# Altium schematic sheet rs232_pic.SchDoc
size A4
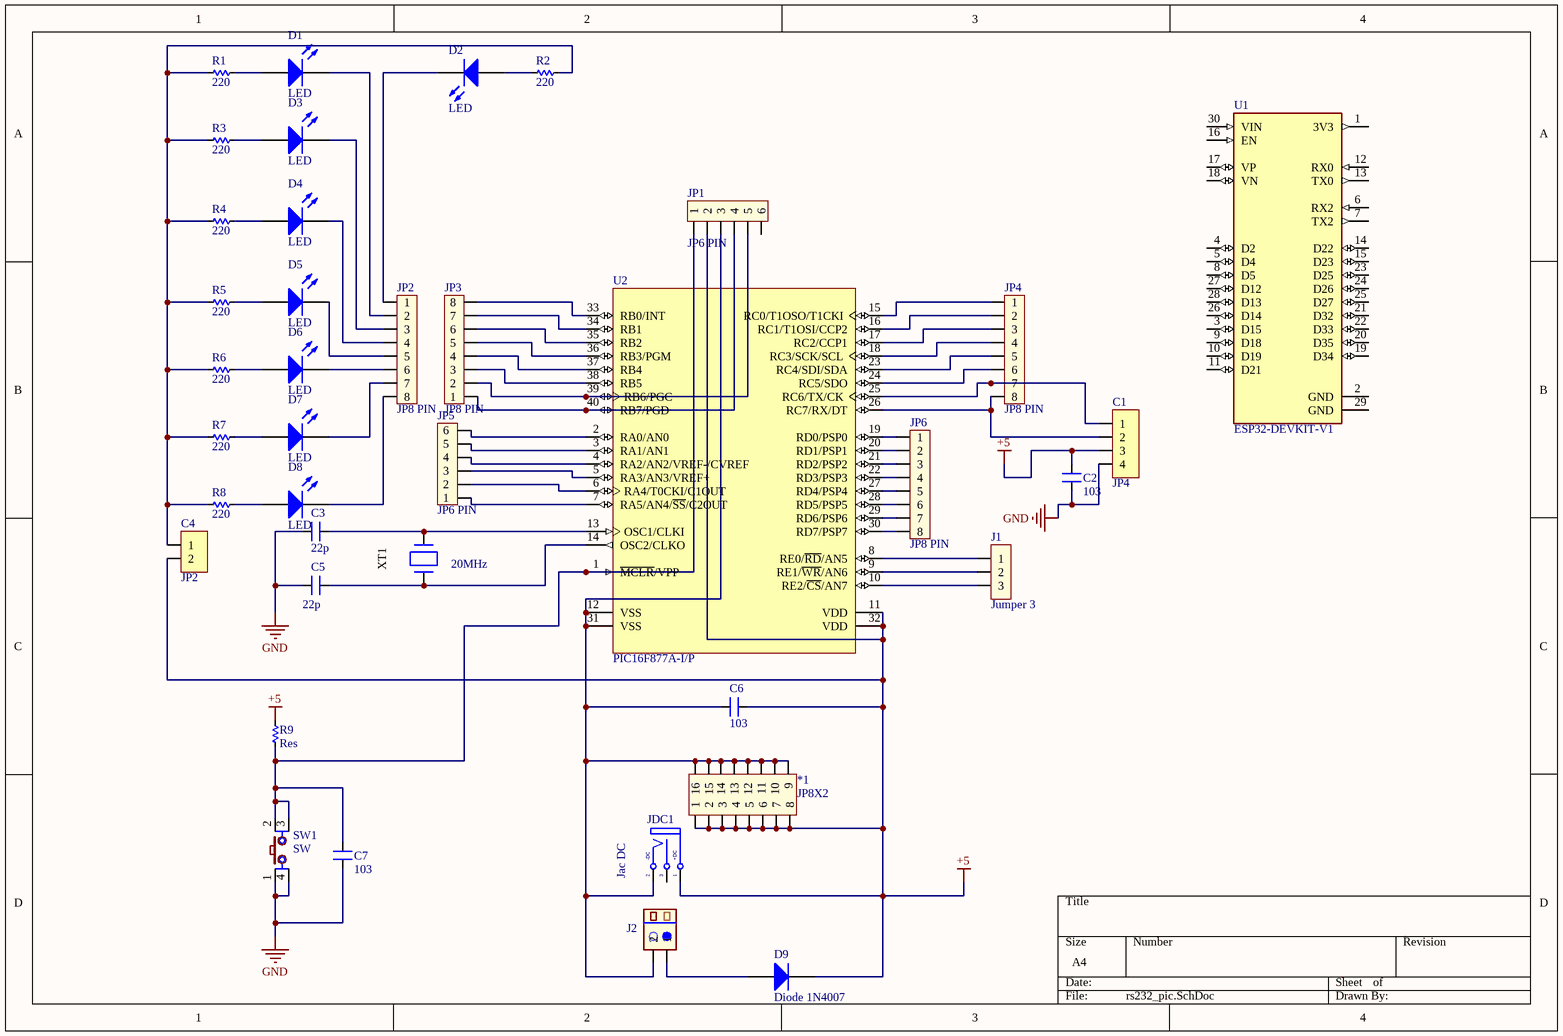
[diagram p0: rs232_pic.SchDoc]

## Parts
*1  JP8X2  [JP8X2]
C1  JP4  [JP4-C1T]
C2  103  [CN1.5]
C3  22p  [CN1.5]
C4  JP2  [JP2-CLOSED]
C5  22p  [CN1.5]
C6  103  [CN1.5]
C7  103  [CN1.5]
D1  LED  [LED-0 5mm BLUE]
D2  LED  [LED-0 5mm BLUE]
D3  LED  [LED-0 5mm BLUE]
D4  LED  [LED-0 5mm BLUE]
D5  LED  [LED-0 5mm BLUE]
D6  LED  [LED-0 5mm BLUE]
D7  LED  [LED-0 5mm BLUE]
D8  LED  [LED-0 5mm BLUE]
D9  Diode 1N4007  [DO-41]
J1  Jumper 3  [JP3]
J2  CON.Domino2  [Domino 2M]  (value not drawn)
JDC1  Jac DC  [DC0]
JP1  JP6 PIN  [JP6]
JP2  JP8 PIN  [JP8]
JP3  JP8 PIN  [JP8]
JP4  JP8 PIN  [JP8]
JP5  JP6 PIN  [JP6]
JP6  JP8 PIN  [JP8]
R1  220  [RES-1/2W]
R2  220  [RES-1/2W]
R3  220  [RES-1/2W]
R4  220  [RES-1/2W]
R5  220  [RES-1/2W]
R6  220  [RES-1/2W]
R7  220  [RES-1/2W]
R8  220  [RES-1/2W]
R9  Res  [RES-1/2W]
SW1  SW  [SW2-DIP]
U1  ESP32-DEVKIT-V1  [MODULE_ESP32_DEVKIT_V1]
U2  PIC16F877A-I/P  [DIP-40]
XT1  value 20MHz  [Crystal.HC49_N]  (hidden comment: Crystal2)

## Nets
+5: *1.1 *1.2 *1.3 *1.4 *1.5 *1.6 *1.7 *1.8 C1.3 C2.1 C4.2 C6.2 D9.2(K) JDC1.1(T) JP1.2 R9.1 U2.11(VDD) U2.32(VDD)
GND: C1.4 C2.2 C3.1 C5.1 C7.2 SW1.1 SW1.4
Net*1_9: *1.9 *1.10 *1.11 *1.12 *1.13 *1.14 *1.15 *1.16 C6.1 J2.2 JDC1.2(TN) JP1.3 U2.12(VSS) U2.31(VSS)
NetC1_1: C1.1 JP4.7 U2.25(RC6/TX/CK)
NetC1_2: C1.2 JP4.8 U2.26(RC7/RX/DT)
NetC3_2: C3.2 U2.13(OSC1/CLKI) XT1.2
NetC4_1: C4.1 R1.1 R2.1 R3.1 R4.1 R5.1 R6.1 R7.1 R8.1
NetC5_2: C5.2 U2.14(OSC2/CLKO) XT1.1
NetC7_1: C7.1 JP1.1 R9.2 SW1.2 SW1.3 U2.1(~{MCLR}/VPP)
NetD1_1: D1.1(A) R1.2
NetD1_2: D1.2(K) JP2.2
NetD2_1: D2.1(A) R2.2
NetD2_2: D2.2(K) JP2.1
NetD3_1: D3.1(A) R3.2
NetD3_2: D3.2(K) JP2.3
NetD4_1: D4.1(A) R4.2
NetD4_2: D4.2(K) JP2.4
NetD5_1: D5.1(A) R5.2
NetD5_2: D5.2(K) JP2.5
NetD6_1: D6.1(A) R6.2
NetD6_2: D6.2(K) JP2.6
NetD7_1: D7.1(A) R7.2
NetD7_2: D7.2(K) JP2.7
NetD8_1: D8.1(A) R8.2
NetD8_2: D8.2(K) JP2.8
NetD9_1: D9.1(A) J2.1
NetJ1_1: J1.1 U2.8(RE0/~{RD}/AN5)
NetJ1_2: J1.2 U2.9(RE1/~{WR}/AN6)
NetJ1_3: J1.3 U2.10(RE2/~{CS}/AN7)
NetJP1_4: JP1.4 JP3.1 U2.40(RB7/PGD)
NetJP1_5: JP1.5 JP3.2 U2.39(RB6/PGC)
NetJP3_3: JP3.3 U2.38(RB5)
NetJP3_4: JP3.4 U2.37(RB4)
NetJP3_5: JP3.5 U2.36(RB3/PGM)
NetJP3_6: JP3.6 U2.35(RB2)
NetJP3_7: JP3.7 U2.34(RB1)
NetJP3_8: JP3.8 U2.33(RB0/INT)
NetJP4_1: JP4.1 U2.15(RC0/T1OSO/T1CKI)
NetJP4_2: JP4.2 U2.16(RC1/T1OSI/CCP2)
NetJP4_3: JP4.3 U2.17(RC2/CCP1)
NetJP4_4: JP4.4 U2.18(RC3/SCK/SCL)
NetJP4_5: JP4.5 U2.23(RC4/SDI/SDA)
NetJP4_6: JP4.6 U2.24(RC5/SDO)
NetJP5_1: JP5.1 U2.7(RA5/AN4/~{SS}/C2OUT)
NetJP5_2: JP5.2 U2.6(RA4/T0CKI/C1OUT)
NetJP5_3: JP5.3 U2.5(RA3/AN3/VREF+)
NetJP5_4: JP5.4 U2.4(RA2/AN2/VREF-/CVREF)
NetJP5_5: JP5.5 U2.3(RA1/AN1)
NetJP5_6: JP5.6 U2.2(RA0/AN0)
NetJP6_1: JP6.1 U2.19(RD0/PSP0)
NetJP6_2: JP6.2 U2.20(RD1/PSP1)
NetJP6_3: JP6.3 U2.21(RD2/PSP2)
NetJP6_4: JP6.4 U2.22(RD3/PSP3)
NetJP6_5: JP6.5 U2.27(RD4/PSP4)
NetJP6_6: JP6.6 U2.28(RD5/PSP5)
NetJP6_7: JP6.7 U2.29(RD6/PSP6)
NetJP6_8: JP6.8 U2.30(RD7/PSP7)

Not connected (* = marked no-connect by the designer): JDC1 3(S); JP1 6; U1 1(3V3) 2(GND) 3(D15) 4(D2) 5(D4) 6(RX2) 7(TX2) 8(D5) 9(D18) 10(D19) 11(D21) 12(RX0) 13(TX0) 14(D22) 15(D23) 16(EN) 17(VP) 18(VN) 19(D34) 20(D35) 21(D32) 22(D33) 23(D25) 24(D26) 25(D27) 26(D14) 27(D12) 28(D13) 29(GND) 30(VIN)

## Notes on the sheet
- (in symbol DCIN) -DC; +DC

## Library data of the parts
C1 = JP4: WR-PHD 2.54 mm Angled Socket Header; Manufacturer: W¨¹rth Elektronik eiSos GmbH; partNo: 613004143121; ComponentLink1 Description: Manufacturer; ComponentLink2 Description: Datasheet; NoPins: 04; Created Date: 29 March 2013; ComponentLink1URL: http://www.we-online.com; ComponentLink2URL: http://katalog.we-online.de/em/datasheet/6130xx143121.pdf; Created by: Karrer Zheng
C2 C3 C5-C7 = CN1.5: Cap np 682pF => 104pF; Value: 0.01uF
C4 = JP2: WR-PHD 2.54 mm Angled Socket Header; Manufacturer: W¨¹rth Elektronik eiSos GmbH; partNo: 613002143121; ComponentLink1 Description: Manufacturer; ComponentLink2 Description: Datasheet; NoPins: 02; Created Date: 29 March 2013; ComponentLink1URL: http://www.we-online.com; ComponentLink2URL: http://katalog.we-online.de/em/datasheet/6130xx143121.pdf; Created by: Karrer Zheng
D1-D8 = LED: Typical LED; Published: 8-Jun-2000; LatestRevisionDate: 08-Jul-2005; LatestRevisionNote: Mech Layer 1 removed.; PackageReference: LED-1; Publisher: Altium Limited
D9 = Diode 1N4007: 1 Amp General Purpose Rectifier; Published: 8-Jun-2000; LatestRevisionDate: 17-Jul-2002; LatestRevisionNote: Re-released for DXP Platform.; DatasheetVersion: 1998; PackageVersion: Aug-1999; PackageReference: DO-41; Publisher: Altium Limited; PackageDescription: Diode, Axial; Body 5.2 x 2.7 mm (LxDia. max), Lead Dia. 0.86 mm (max); Code_JEDEC: DO-204-AL; ComponentLink1Description: Manufacturer Link; ComponentLink1URL: http://www.fairchildsemi.com/; ComponentLink2Description: Datasheet; ComponentLink2URL: http://www.fairchildsemi.com/ds/1N%2F1N4001.pdf
J1 = JP3: Value: J3
J2 = CON.Domino2: 2 pins Domino Header; Publisher: Hoang Nguyen; ComponentLink1Description: Digikey Part link; ComponentLink2Description: Open DataSheet; ComponentLink2URL: H:\LIBRARY\LIBRARY.Datasheet\; Price: 2000VND
JDC1 = DCIN: Jac DC input; Value: Jac DC
JP1 JP5 = JP6: Value: JP7
JP2-JP4 JP6 = JP8: Value: JP7
R1-R9 = Res: Manufacturer: Generic Components; Class: Passive; SubClass: R; Published: 08/06/2000; Publisher: Altium Hobart Technology Centre
SW1 = SW4: Switch button 4 pin; Value: Button chip 4 pin
U1 = ESP32-DEVKIT-V1: Dual core, Wi-Fi: 2.4 GHz up to 150 Mbits/s,BLE (Bluetooth Low Energy) and legacy Bluetooth, 32 bits, Up to 240 MHz; MF: Do it; Value: *; MP: ESP32-DEVKIT-V1; SnapEDA_Link: https://www.snapeda.com/parts/ESP32-DEVKIT-V1/Do+it/view-part/?ref=snap; Price: None; Package: None; Check_prices: https://www.snapeda.com/parts/ESP32-DEVKIT-V1/Do+it/view-part/?ref=eda; Availability: Not in stock
U2 = PIC16F877A-I/P: Enhanced FLASH Microcontroller, 8K (x14-Bit words) FLASH, 368 Bytes RAM, 40-Pin PDIP, Standard VDD Range, Industrial Temperature; Note: 25mA sink/source per I/O.; Published: 11-Oct-2004; LatestRevisionDate: 04-Mar-2005; LatestRevisionNote: Stylized 3D Model Added.; DatasheetVersion: DS39582B_2003; PackageVersion: 2003; PackageReference: PDIP600-40; Publisher: Altium Limited; PackageDescription: DIP, Plastic; 40 Leads; Row Spacing 15.24 mm; Pitch 2.54 mm; Code_JEDEC: MO-011; ComponentLink1Description: Manufacturer Link; ComponentLink1URL: http://www.microchip.com; ComponentLink2Description: Datasheet; ComponentLink2URL: http://ww1.microchip.com/downloads/en/DeviceDoc/39582b.pdf; ComponentLink3Description: Packaging Specification; ComponentLink3URL: http://ww1.microchip.com/downloads/en/PackagingSpec/00049AD.pdf
XT1 = Crystal2: Quarz Crystal; Vendor: Digikey; Published: 13-April-2009; Publisher: Hoang Nguyen; ComponentLink1Description: Digikey Part Link; ComponentLink2Description: Open Datasheet; ComponentLink2URL: H:\LIBRARY\LIBRARY.Datasheet\; Price: 2000 VND